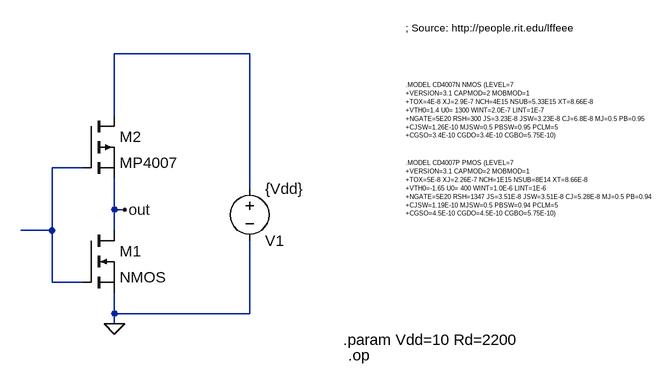
[diagram p0: schematic LAB11c.asc]
LAB11c.asc, the LTspice schematic file:
Version 4
SHEET 1 1092 680
WIRE 416 -144 208 -144
WIRE 208 -48 208 -144
WIRE 160 32 112 32
WIRE 416 64 416 -144
WIRE 208 96 208 48
WIRE 224 96 208 96
WIRE 112 128 112 32
WIRE 112 128 64 128
WIRE 208 128 208 96
WIRE 112 208 112 128
WIRE 160 208 112 208
WIRE 208 256 208 224
WIRE 416 256 416 144
WIRE 416 256 208 256
WIRE 208 272 208 256
FLAG 208 272 0
FLAG 224 96 out
DATAFLAG 208 256 ""
SYMBOL voltage 416 48 R0
WINDOW 0 24 96 Left 2
WINDOW 3 24 16 Left 2
WINDOW 123 0 0 Left 0
WINDOW 39 0 0 Left 0
SYMATTR InstName V1
SYMATTR Value {Vdd}
SYMBOL nmos 160 128 R0
SYMATTR InstName M1
SYMBOL pmos 160 -48 R0
SYMATTR InstName M2
SYMATTR Value MP4007
TEXT 568 320 Left 2 !.op
TEXT 560 296 Left 2 !.param Vdd=10 Rd=2200
TEXT 656 -96 Left 0 !.MODEL CD4007N NMOS (LEVEL=7\n+VERSION=3.1 CAPMOD=2 MOBMOD=1\n+TOX=4E-8 XJ=2.9E-7 NCH=4E15 NSUB=5.33E15 XT=8.66E-8 \n+VTH0=1.4 U0= 1300 WINT=2.0E-7 LINT=1E-7 \n+NGATE=5E20 RSH=300 JS=3.23E-8 JSW=3.23E-8 CJ=6.8E-8 MJ=0.5 PB=0.95\n+CJSW=1.26E-10 MJSW=0.5 PBSW=0.95 PCLM=5\n+CGSO=3.4E-10 CGDO=3.4E-10 CGBO=5.75E-10)
TEXT 656 -184 Left 1 !; Source: http://people.rit.edu/lffeee
TEXT 656 24 Left 0 !.MODEL CD4007P PMOS (LEVEL=7\n+VERSION=3.1 CAPMOD=2 MOBMOD=1\n+TOX=5E-8 XJ=2.26E-7 NCH=1E15 NSUB=8E14 XT=8.66E-8\n+VTH0=-1.65 U0= 400 WINT=1.0E-6 LINT=1E-6\n+NGATE=5E20 RSH=1347 JS=3.51E-8 JSW=3.51E-8 CJ=5.28E-8 MJ=0.5 PB=0.94\n+CJSW=1.19E-10 MJSW=0.5 PBSW=0.94 PCLM=5\n+CGSO=4.5E-10 CGDO=4.5E-10 CGBO=5.75E-10)

The netlist it stands for:
* LAB11c.asc
V1 N001 0 {Vdd}
M1 out N002 0 0 NMOS
M2 N001 N002 out out MP4007
.model NMOS NMOS
.model PMOS PMOS
.lib standard.mos
.op
.param Vdd=10 Rd=2200
.MODEL CD4007N NMOS (LEVEL=7
+VERSION=3.1 CAPMOD=2 MOBMOD=1
+TOX=4E-8 XJ=2.9E-7 NCH=4E15 NSUB=5.33E15 XT=8.66E-8
+VTH0=1.4 U0= 1300 WINT=2.0E-7 LINT=1E-7
+NGATE=5E20 RSH=300 JS=3.23E-8 JSW=3.23E-8 CJ=6.8E-8 MJ=0.5 PB=0.95
+CJSW=1.26E-10 MJSW=0.5 PBSW=0.95 PCLM=5
+CGSO=3.4E-10 CGDO=3.4E-10 CGBO=5.75E-10)
; Source: http://people.rit.edu/lffeee
.MODEL CD4007P PMOS (LEVEL=7
+VERSION=3.1 CAPMOD=2 MOBMOD=1
+TOX=5E-8 XJ=2.26E-7 NCH=1E15 NSUB=8E14 XT=8.66E-8
+VTH0=-1.65 U0= 400 WINT=1.0E-6 LINT=1E-6
+NGATE=5E20 RSH=1347 JS=3.51E-8 JSW=3.51E-8 CJ=5.28E-8 MJ=0.5 PB=0.94
+CJSW=1.19E-10 MJSW=0.5 PBSW=0.94 PCLM=5
+CGSO=4.5E-10 CGDO=4.5E-10 CGBO=5.75E-10)
.backanno
.end